# EAGLE schematic project 2 schematic (EAGLE 7.6.0)
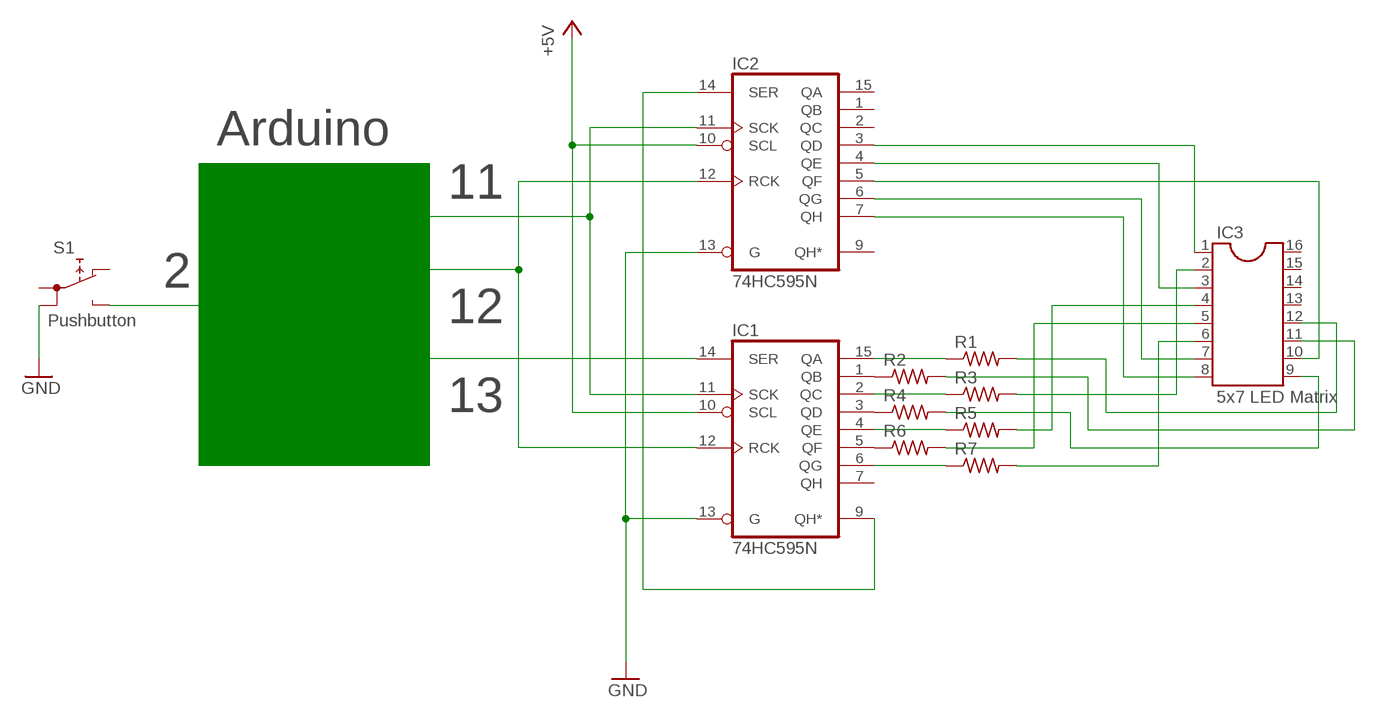
[diagram p0: schematic, sheet 1]

## Parts
IC1  74HC595N  [DIL16]
IC2  74HC595N  [DIL16]
IC3  5x7 LED Matrix  DIL16  [DIL16]
R1  R-US_0207/10  [0207/10]
R2  R-US_0207/10  [0207/10]
R3  R-US_0207/10  [0207/10]
R4  R-US_0207/10  [0207/10]
R5  R-US_0207/10  [0207/10]
R6  R-US_0207/10  [0207/10]
R7  R-US_0207/10  [0207/10]
S1  Pushbutton  5501  [5501]

## Nets
+5V: IC1.10(SCL) IC2.10(SCL)
GND: IC1.13(G) IC2.13(G) S1.1B
N$1: IC1.9(QH*) IC2.14(SER)
N$2: IC1.11(SCK) IC2.11(SCK)
N$3: IC1.1(QB) R2.1
N$4: IC1.2(QC) R3.1
N$5: IC1.12(RCK) IC2.12(RCK)
N$6: IC1.14(SER)
N$7: IC3.12 R1.2
N$8: IC3.11 R2.2
N$9: IC3.2 R3.2
N$10: IC3.9 R4.2
N$11: IC3.4 R5.2
N$12: IC3.5 R6.2
N$13: IC3.6 R7.2
N$14: IC2.3(QD) IC3.1
N$15: IC2.4(QE) IC3.3
N$16: IC2.5(QF) IC3.10
N$17: IC2.6(QG) IC3.7
N$18: IC2.7(QH) IC3.8
N$19: IC1.15(QA) R1.1
N$20: IC1.3(QD) R4.1
N$21: IC1.4(QE) R5.1
N$22: IC1.5(QF) R6.1
N$23: IC1.6(QG) R7.1
N$24: S1.NO
Unconnected: IC1.7(QH) IC2.1(QB) IC2.2(QC) IC2.9(QH*) IC2.15(QA) IC3.13 IC3.14 IC3.15 IC3.16 S1.1A S1.NC

## Notes on the sheet
- Arduino
- 11
- 2
- 12
- 13

## Power pins joined to a net without a drawn wire
GND: IC1.8(GND) IC2.8(GND)
VCC: IC1.16(VCC) IC2.16(VCC)

## Library data of the parts
IC1 IC2 = 74xx-eu:74*595: 8-bit SHIFT REGISTER, output latch
IC3 = ic-package:DIL16: Dual In Line / Socket
R1-R7 = rcl:R-US_: RESISTOR, American symbol
S1 = switch:55?: PUSHBUTTON SERIES 5500 SWITCHES Source: www.e-switch.com .. 5500.pdf